# Altium project ARM_DIL_Platine.PrjPCB
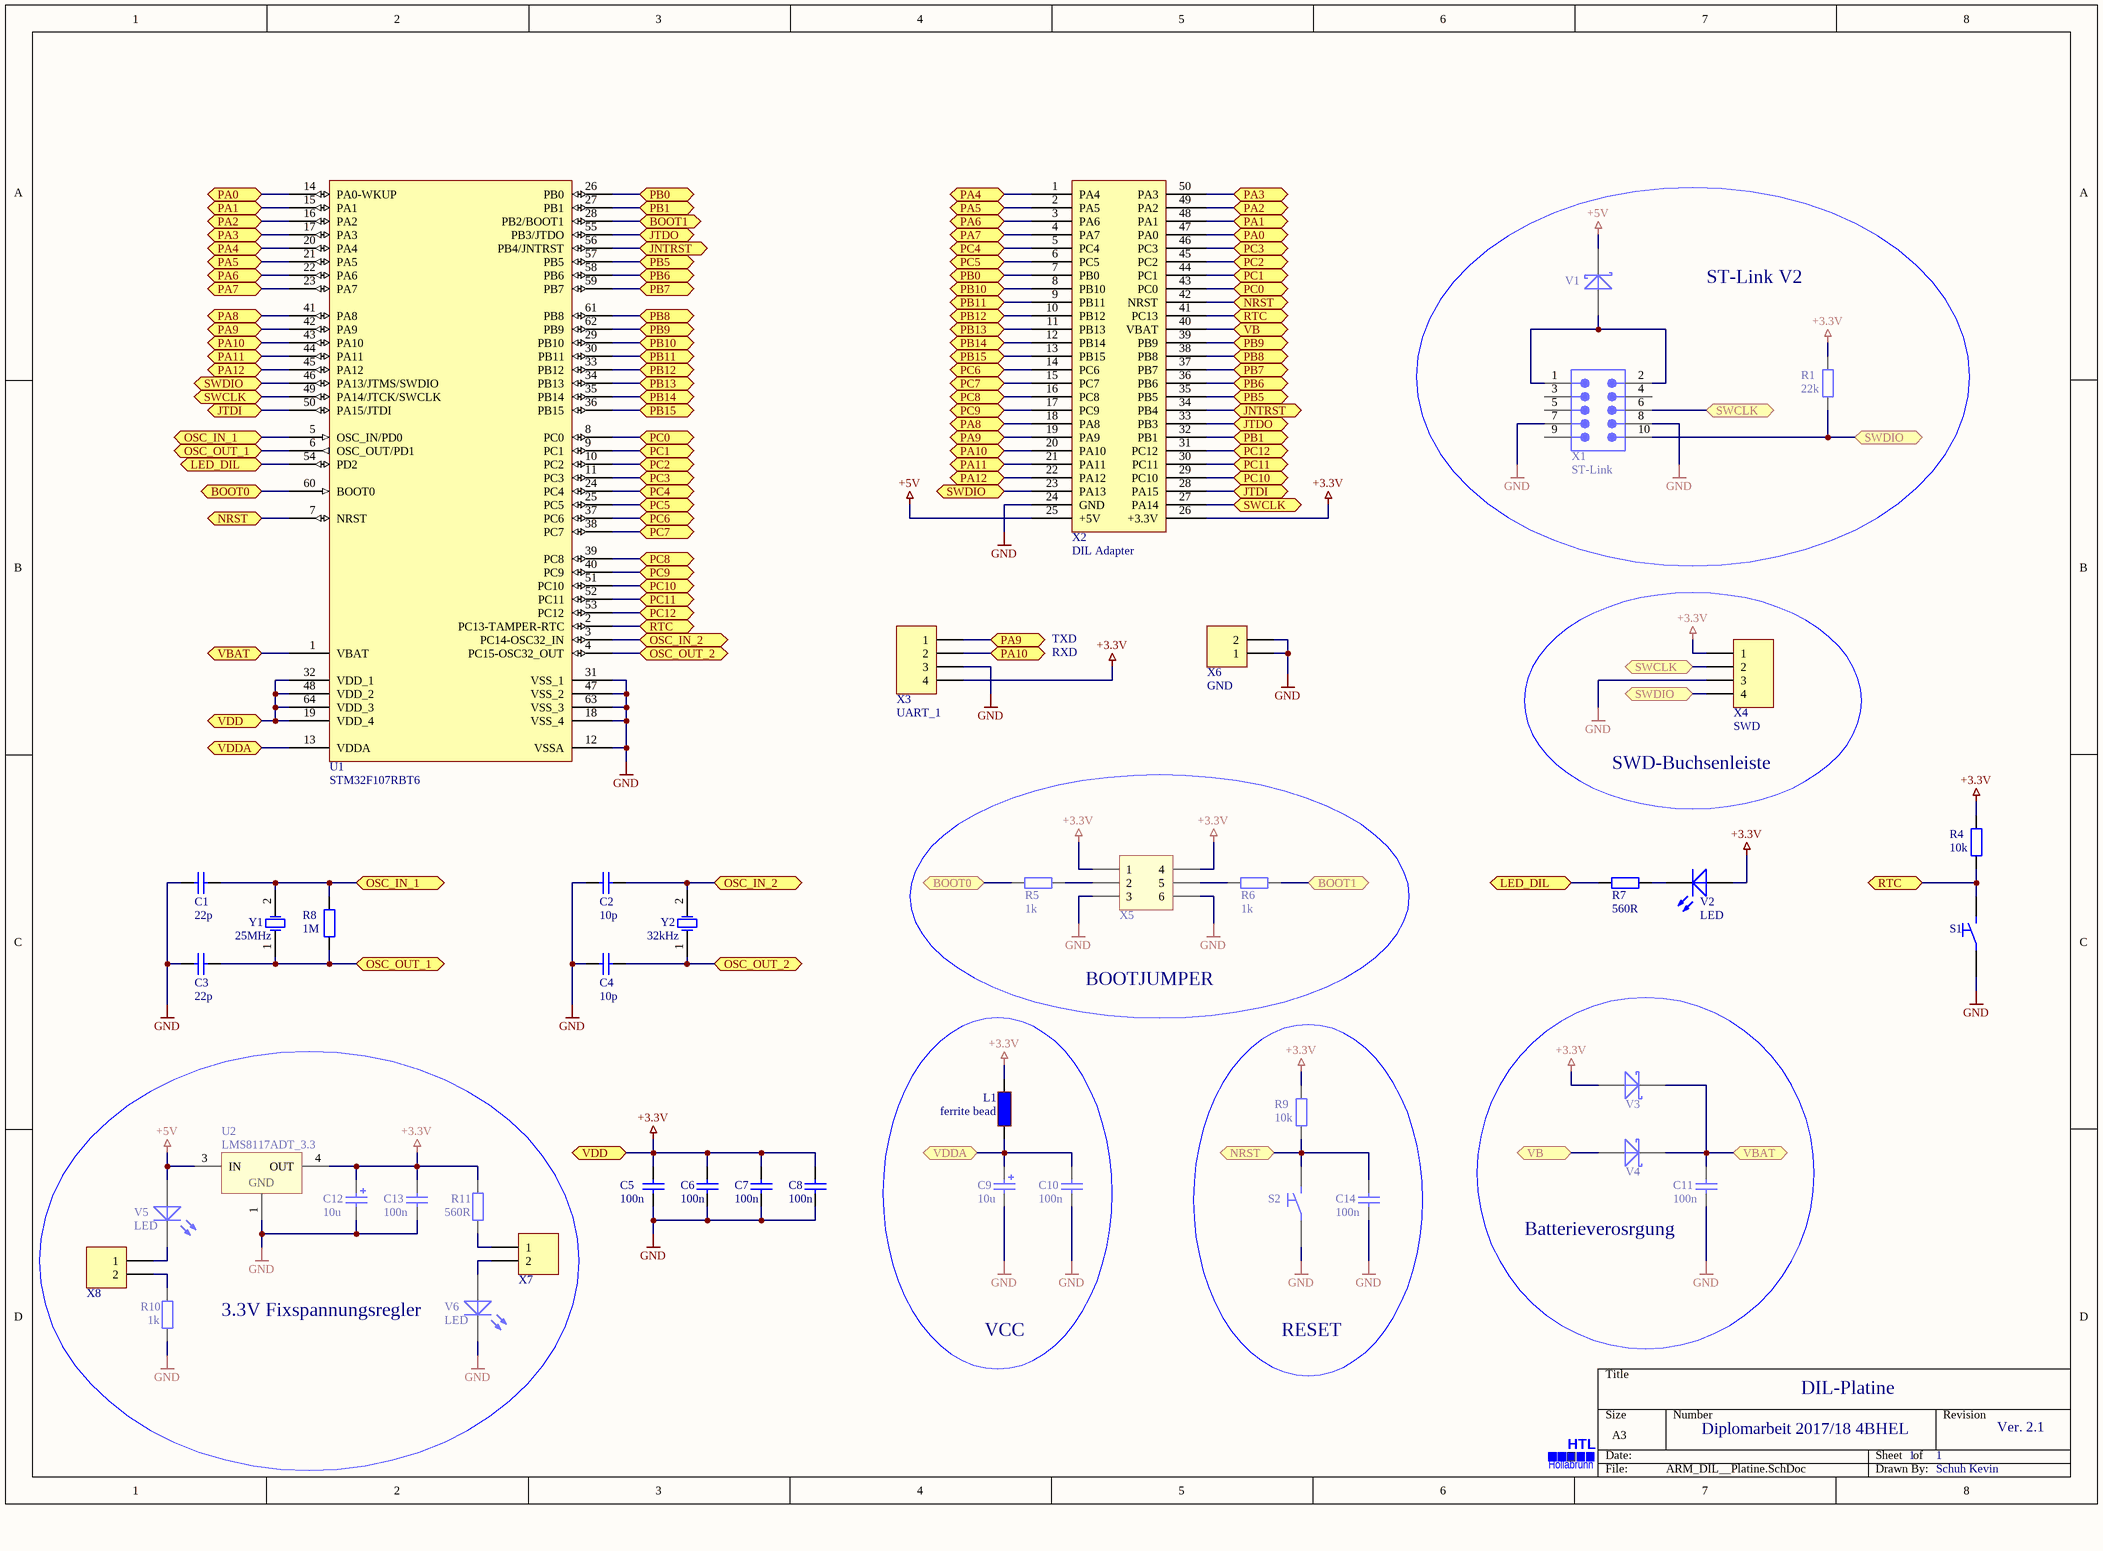
[diagram p0: ARM_DIL__Platine.SchDoc]
1 sheet, 45 parts. Net scope: flat (ports and power ports of the same name join across sheets).
Board files: ARM_DIL_Platine.PcbDoc, PCB1.PcbDoc

## Sheet ARM_DIL__Platine.SchDoc
size A3; PageSetup: Record=PageOptions|CenterHorizontal=True|CenterVertical=True|PrintScale=0.73|XCorrection=1.00|YCorrection=1.00|PrintKind=0|BorderSize=5000000|LeftOffset=0|BottomOffset=0|Orientation=2|PaperLength=1000|PaperWidth=1000|Scale=100|PaperSource=7|PrintQuality=-3|MediaType=1|DitherType=10|PrintScaleMode=1|PaperKind=A4|PaperIndex=9

### Parts
C1  value 22p  [0805_CAP]  (hidden comment: Cap)
C2  value 10p  [0805_CAP]  (hidden comment: Cap)
C3  value 22p  [0805_CAP]  (hidden comment: Cap)
C4  value 10p  [0805_CAP]  (hidden comment: Cap)
C5  value 100n  [0805_CAP]  (hidden comment: Cap)
C6  value 100n  [0805_CAP]  (hidden comment: Cap)
C7  value 100n  [0805_CAP]  (hidden comment: Cap)
C8  value 100n  [0805_CAP]  (hidden comment: Cap)
C9  value 10u  [1411_Cap_Pol]  (hidden comment: Cap Pol)
C10  value 100n  [0805_CAP]  (hidden comment: Cap)
C11  value 100n  [0805_CAP]  (hidden comment: Cap)
C12  value 10u  [1411_Cap_Pol]  (hidden comment: Cap Pol)
C13  value 100n  [0805_CAP]  (hidden comment: Cap)
C14  value 100n  [0805_CAP]  (hidden comment: Cap)
L1  ferrite bead  [0805_ferrit]
Logo  HTL Hollabrunn  [HTL_Logo]  (value not drawn)
R1  value 22k  [0805_Res]  (hidden comment: Res)
R4  value 10k  [0805_Res]  (hidden comment: Res)
R5  value 1k  [0805_Res]  (hidden comment: Res)
R6  value 1k  [0805_Res]  (hidden comment: Res)
R7  value 560R  [0805_Res]  (hidden comment: Res)
R8  value 1M  [0805_Res]  (hidden comment: Res)
R9  value 10k  [0805_Res]  (hidden comment: Res)
R10  value 1k  [0805_Res]  (hidden comment: Res)
R11  value 560R  [0805_Res]  (hidden comment: Res)
S1  SW_SPST  [Printtaster]  (value not drawn)
S2  SW_SPST  [Printtaster]  (value not drawn)
U1  STM32F107RBT6  [STM32F103RBT6]
U2  LMS8117ADT_3.3  [TD03B_N_Low_Dropout_Regulator]
V1  D Schottky  [BAT254_Schottky]  (value not drawn)
V2  LED  [0805_LED]
V3  D Schottky  [BAT254_Schottky]  (value not drawn)
V4  D Schottky  [BAT254_Schottky]  (value not drawn)
V5  LED  [0805_LED]
V6  LED  [0805_LED]
X1  ST-Link  [HDR2X5_STLink]
X2  DIL Adapter  [DIL_Adapter_V03]
X3  UART_1  [HDR1X4_UART]
X4  SWD  [HDR1X4_SWD]
X5  Header 3x2  [HDR2X3]  (value not drawn)
X6  GND  [HDR1X2]
X7  (no value)  [HDR1X2]
X8  (no value)  [HDR1X2]
Y1  25MHz  [Schwingquarz_8MHz_TOP]
Y2  32kHz  [Schwingquarz_32k]

### Ports
BOOT0, BOOT1, JNTRST, JTDI, JTDO, LED_DIL, NRST, OSC_IN_1, OSC_IN_2, OSC_OUT_1, OSC_OUT_2, PA0, PA1, PA2, PA3, PA4, PA5, PA6, PA7, PA8, PA9, PA10, PA11, PA12, PB0, PB1, PB5, PB6, PB7, PB8, PB9, PB10, PB11, PB12, PB13, PB14, PB15, PC0, PC1, PC2, PC3, PC4, PC5, PC6, PC7, PC8, PC9, PC10, PC11, PC12, RTC, SWCLK, SWDIO, VB, VBAT, VDD, VDDA

### Nets
+3.3V: C5.2 C6.2 C7.2 C8.2 C12.1 C13.2 L1.2 R1.2 R4.2 R9.2 R11.1 U1.19(VDD_4) U1.32(VDD_1) U1.48(VDD_2) U1.64(VDD_3) U2.4(OUT) V2.1(A) V3.1(A) X2.26(+3.3V) X3.4 X4.1 X5.1 X5.4 ; port VDD
+5V: U2.3(IN) V1.2(K) V5.1(A) X2.25(+5V)
GND: C1.1 C2.1 C3.2 C4.2 C5.1 C6.1 C7.1 C8.1 C9.2 C10.1 C11.1 C12.2 C13.1 C14.1 R10.1 S1.1(COMMON) S2.1(COMMON) U1.12(VSSA) U1.18(VSS_4) U1.31(VSS_1) U1.47(VSS_2) U1.63(VSS_3) U2.1(GND) V6.2(K) X1.7 X1.8 X2.24(GND) X3.3 X4.3 X5.3 X5.6 X6.1 X6.2
NetC1_2: C1.2 R8.2 U1.5(OSC_IN/PD0) Y1.2(OSC2) ; port OSC_IN_1
NetC2_2: C2.2 U1.3(PC14-OSC32_IN) Y2.2(OSC2) ; port OSC_IN_2
NetC3_1: C3.1 R8.1 U1.6(OSC_OUT/PD1) Y1.1(OSC1) ; port OSC_OUT_1
NetC4_1: C4.1 U1.4(PC15-OSC32_OUT) Y2.1(OSC1) ; port OSC_OUT_2
NetC9_1: C9.1 C10.2 L1.1 U1.13(VDDA) ; port VDDA
NetC11_2: C11.2 U1.1(VBAT) V3.2(K) V4.2(K) ; port VBAT
NetC14_2: C14.2 R9.1 S2.2(NO) U1.7(NRST) X2.42(NRST) ; port NRST
NetR1_1: R1.1 U1.46(PA13/JTMS/SWDIO) X1.10 X2.23(PA13) X4.4 ; port SWDIO
NetR4_1: R4.1 S1.2(NO) U1.2(PC13-TAMPER-RTC) X2.41(PC13) ; port RTC
NetR5_1: R5.1 X5.2
NetR5_2: R5.2 U1.60(BOOT0) ; port BOOT0
NetR6_1: R6.1 U1.28(PB2/BOOT1) ; port BOOT1
NetR6_2: R6.2 X5.5
NetR7_1: R7.1 V2.2(K)
NetR7_2: R7.2 U1.54(PD2) ; port LED_DIL
NetR10_2: R10.2 X8.2
NetR11_2: R11.2 X7.1
NetU1_8: U1.8(PC0) X2.43(PC0) ; port PC0
NetU1_9: U1.9(PC1) X2.44(PC1) ; port PC1
NetU1_10: U1.10(PC2) X2.45(PC2) ; port PC2
NetU1_11: U1.11(PC3) X2.46(PC3) ; port PC3
NetU1_14: U1.14(PA0-WKUP) X2.47(PA0) ; port PA0
NetU1_15: U1.15(PA1) X2.48(PA1) ; port PA1
NetU1_16: U1.16(PA2) X2.49(PA2) ; port PA2
NetU1_17: U1.17(PA3) X2.50(PA3) ; port PA3
NetU1_20: U1.20(PA4) X2.1(PA4) ; port PA4
NetU1_21: U1.21(PA5) X2.2(PA5) ; port PA5
NetU1_22: U1.22(PA6) X2.3(PA6) ; port PA6
NetU1_23: U1.23(PA7) X2.4(PA7) ; port PA7
NetU1_24: U1.24(PC4) X2.5(PC4) ; port PC4
NetU1_25: U1.25(PC5) X2.6(PC5) ; port PC5
NetU1_26: U1.26(PB0) X2.7(PB0) ; port PB0
NetU1_27: U1.27(PB1) X2.32(PB1) ; port PB1
NetU1_29: U1.29(PB10) X2.8(PB10) ; port PB10
NetU1_30: U1.30(PB11) X2.9(PB11) ; port PB11
NetU1_33: U1.33(PB12) X2.10(PB12) ; port PB12
NetU1_34: U1.34(PB13) X2.11(PB13) ; port PB13
NetU1_35: U1.35(PB14) X2.12(PB14) ; port PB14
NetU1_36: U1.36(PB15) X2.13(PB15) ; port PB15
NetU1_37: U1.37(PC6) X2.14(PC6) ; port PC6
NetU1_38: U1.38(PC7) X2.15(PC7) ; port PC7
NetU1_39: U1.39(PC8) X2.16(PC8) ; port PC8
NetU1_40: U1.40(PC9) X2.17(PC9) ; port PC9
NetU1_41: U1.41(PA8) X2.18(PA8) ; port PA8
NetU1_42: U1.42(PA9) X2.19(PA9) X3.1 ; port PA9
NetU1_43: U1.43(PA10) X2.20(PA10) X3.2 ; port PA10
NetU1_44: U1.44(PA11) X2.21(PA11) ; port PA11
NetU1_45: U1.45(PA12) X2.22(PA12) ; port PA12
NetU1_49: U1.49(PA14/JTCK/SWCLK) X1.6 X2.27(PA14) X4.2 ; port SWCLK
NetU1_50: U1.50(PA15/JTDI) X2.28(PA15) ; port JTDI
NetU1_51: U1.51(PC10) X2.29(PC10) ; port PC10
NetU1_52: U1.52(PC11) X2.30(PC11) ; port PC11
NetU1_53: U1.53(PC12) X2.31(PC12) ; port PC12
NetU1_55: U1.55(PB3/JTDO) X2.33(PB3) ; port JTDO
NetU1_56: U1.56(PB4/JNTRST) X2.34(PB4) ; port JNTRST
NetU1_57: U1.57(PB5) X2.35(PB5) ; port PB5
NetU1_58: U1.58(PB6) X2.36(PB6) ; port PB6
NetU1_59: U1.59(PB7) X2.37(PB7) ; port PB7
NetU1_61: U1.61(PB8) X2.38(PB8) ; port PB8
NetU1_62: U1.62(PB9) X2.39(PB9) ; port PB9
NetV1_1: V1.1(A) X1.1 X1.2
NetV4_1: V4.1(A) X2.40(VBAT) ; port VB
NetV5_2: V5.2(K) X8.1
NetV6_1: V6.1(A) X7.2

Not connected (* = marked no-connect by the designer): X1 3 4 5 9

### Notes on the sheet
- ST-Link V2
- TXD
- RXD
- SWD-Buchsenleiste
- BOOTJUMPER
- (near C11) Batterieverosrgung
- (near V6) 3.3V Fixspannungsregler
- VCC
- RESET
- DIL-Platine
- Diplomarbeit 2017/18 4BHEL
- 1
- Ver. 2.1
- Schuh Kevin
- (in symbol HTL Logo) HTL; Hollabrunn

### Library data of the parts
C1-C8 C10 C11 C13 C14 = Cap: Capacitor; Published: 8-Jun-2000; LatestRevisionDate: 17-Jul-2002; LatestRevisionNote: Re-released for DXP Platform.; PackageReference: RAD-0.3; Publisher: Altium Limited
C9 C12 = Cap_Pol: Polarized Capacitor (Radial); Published: 8-Jun-2000; LatestRevisionDate: 17-Jul-2002; LatestRevisionNote: Re-released for DXP Platform.; PackageReference: RB7.6-15; Publisher: Altium Limited
L1 = Inductor: Code_IEC: 1005; Value: 10mH; Published: 8-Jun-2000; LatestRevisionDate: 17-Jul-2002; LatestRevisionNote: Re-released for DXP Platform.; PackageReference: 0402-A; Publisher: Altium Limited; Code_JEITA: 0402
Logo = HTL Logo
R1 R4-R11 = Res: Resistor; Published: 8-Jun-2000; LatestRevisionDate: 17-Jul-2002; LatestRevisionNote: Re-released for DXP Platform.; PackageReference: AXIAL-0.4; Publisher: Altium Limited
S1 S2 = SW_SPST: Single-Pole, Single-Throw Switch; Published: 24-Mar-1999; LatestRevisionDate: 17-Jul-2002; LatestRevisionNote: Re-released for DXP Platform.; PackageReference: SPST-2; Publisher: Altium Limited
U1 = STM32F103RBT6: STM32 ARM-based 32-bit MCU with 128 Kbytes Flash, 64-pin LQFP, Industrial Temperature; Published: 30-May-2008; DatasheetVersion: rev6, Mar-2008; PackageVersion: Mar-2008; PackageReference: LQFP64; Publisher: Altium Limited; PackageDescription: 64-Pin Low-Profile Quad Flat Pack, 10 x 10 mm Body, 0.5 mm Pitch (LQFP64); ComponentLink1Description: Manufacturer Link; ComponentLink1URL: www.st.com/stm32; ComponentLink2Description: Datasheet; ComponentLink2URL: http://www.st.com/stonline/products/literature/ds/13587.pdf
U2 = LMS8117ADT_3.3: 1A Low-Dropout Linear Regulator; PartNumber: LMS8117ADT-3.3; Manufacturer: National Semiconductor; CompType: LDO IC; PackageTopMarking: NSUZXYTT*LMS8117*ADT-3.3; PowerWise: N; Published: 4-Dec-2008; DatasheetVersion: Apr-2005; PackageVersion: revC, Apr-2003; PackageReference: TD03B; Publisher: Altium Limited; PackageDescription: TO252, Molded, Jedec, 6.8 x 6.10 x 2.30mm Body, 3 Lead, 2.28mm Pitch, Surface Mount; RoHS: O; PinCount: 3; DigiKeyPartNumber: LMS8117ADT-3.3-ND; Code_JEDEC: TO-252-AA; ComponentLink1Description: LMS8117A Datasheet; ComponentLink1URL: http://www.national.com/ds/LM/LMS8117A.pdf; ComponentLink2Description: LMS8117A Web Page; ComponentLink2URL: http://www.national.com/pf/LM/LMS8117A.html; ComponentLink3Description: TD03B Package Page; ComponentLink3URL: http://www.national.com/packaging/folders/td03b.html
V1 V3 V4 = D_Schottky: Schottky Diode; Published: 8-Jun-2000; LatestRevisionDate: 17-Jul-2002; LatestRevisionNote: Re-released for DXP Platform.; PackageReference: SMB; Publisher: Altium Limited; Code_JEDEC: DO-214-AA
V2 V5 V6 = LED: Typical RED, GREEN, YELLOW, AMBER GaAs LED; Published: 8-Jun-2000; LatestRevisionDate: 17-Jul-2002; LatestRevisionNote: Re-released for DXP Platform.; PackageDocument: Feb-2002; PackageReference: 3.2X1.6X1.1; Publisher: Altium Limited
X1 = STLink: Flat Cable Connector (IDC), Low-Profile Male Header, Straight Solder Pin, 20 Contacts, Performance Level 2; PCB_Layout: Complies with manufacturer's recommendation.; DrillSize: Corresponds to nominal value.; Published: 15-Nov-2004; DatasheetDocument: Sep-2003; PackageDocument: 01-Feb-2000; PackageReference: 918520x324; Publisher: Altium Limited; ComponentLink1Description: Manufacturer Link; ComponentLink1URL: http://www.harting.com/; ComponentLink2Description: Selection Guide; ComponentLink2URL: http://www.harting.com/imperia/md/content/steckverbinderundsystemkomponenten/folder/interface_engl_chapter_09.pdf
X2 = DIL_Adapter_V03: DIL Adapter 50 Pin
X3 = UART_1: Header, 4-Pin; LatestRevisionDate: 17-Jul-2002; LatestRevisionNote: Re-released for DXP Platform.; Publisher: Altium Limited
X4 = SWD: Header, 4-Pin; LatestRevisionDate: 17-Jul-2002; LatestRevisionNote: Re-released for DXP Platform.; Publisher: Altium Limited
X5 = Header 3x2: Header, 3-Pin, Dual row; LatestRevisionDate: 17-Jul-2002; LatestRevisionNote: Re-released for DXP Platform.; Publisher: Altium Limited
X6-X8 = Header_2: Header, 2-Pin; LatestRevisionDate: 17-Jul-2002; LatestRevisionNote: Re-released for DXP Platform.; Publisher: Altium Limited
Y1 Y2 = 3SMXA: Surface Mount Quartz Crystal; Note: PCB layout complies with manufacturer's recommendation.; Published: 17-Jul-2002; DatasheetDocument: 6-Apr-1998; PackageDocument: 6-Apr-1998; PackageReference: 3SMXA; Publisher: Altium Limited; ComponentLink1Description: Manufacturer Link; ComponentLink1URL: http://www.cmac.com/mt/; ComponentLink2Description: Datasheet; ComponentLink2URL: http://www.cmac.com/mt/databook/crystals/smd/3smx.pdf